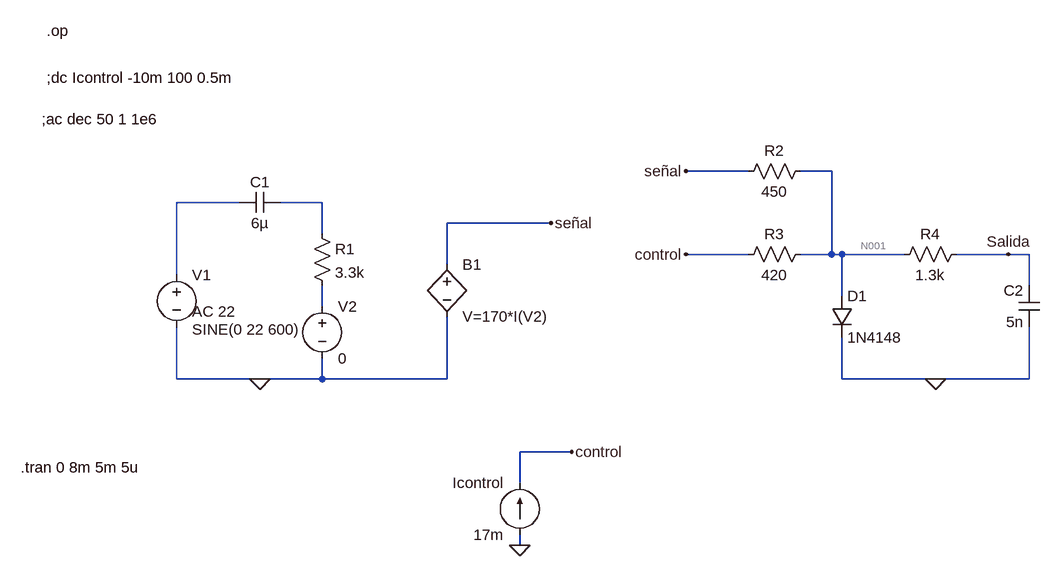
[diagram p0: schematic Draft1.asc]
Draft1.asc, the LTspice schematic file:
Version 4
SHEET 1 1340 680
WIRE 832 -96 736 -96
WIRE 960 -96 912 -96
WIRE 48 -48 -48 -48
WIRE 176 -48 112 -48
WIRE 528 -16 368 -16
WIRE 176 0 176 -48
WIRE 832 32 736 32
WIRE 960 32 960 -96
WIRE 960 32 912 32
WIRE 976 32 960 32
WIRE 1072 32 976 32
WIRE 1232 32 1152 32
WIRE 1264 32 1232 32
WIRE 368 48 368 -16
WIRE -48 64 -48 -48
WIRE 1264 80 1264 32
WIRE 976 96 976 32
WIRE 176 112 176 80
WIRE -48 224 -48 144
WIRE 80 224 -48 224
WIRE 176 224 176 192
WIRE 176 224 80 224
WIRE 368 224 368 128
WIRE 368 224 176 224
WIRE 976 224 976 160
WIRE 1120 224 976 224
WIRE 1264 224 1264 144
WIRE 1264 224 1120 224
WIRE 560 336 480 336
WIRE 480 384 480 336
WIRE 480 480 480 464
FLAG 80 224 0
FLAG 1120 224 0
FLAG 480 480 0
FLAG 736 -96 señal
FLAG 528 -16 señal
FLAG 736 32 control
FLAG 560 336 control
FLAG 1232 32 Salida
SYMBOL voltage -48 48 R0
WINDOW 3 24 100 Left 2
WINDOW 123 24 72 Left 2
WINDOW 39 0 0 Left 0
SYMATTR Value SINE(0 22 600)
SYMATTR Value2 AC 22
SYMATTR InstName V1
SYMBOL voltage 176 96 R0
WINDOW 123 0 0 Left 0
WINDOW 39 0 0 Left 0
SYMATTR InstName V2
SYMATTR Value 0
SYMBOL cap 112 -64 R90
WINDOW 0 0 32 VBottom 2
WINDOW 3 32 32 VTop 2
SYMATTR InstName C1
SYMATTR Value 6µ
SYMBOL cap 1280 144 R180
WINDOW 0 24 56 Left 2
WINDOW 3 24 8 Left 2
SYMATTR InstName C2
SYMATTR Value 5n
SYMBOL res 160 -16 R0
SYMATTR InstName R1
SYMATTR Value 3.3k
SYMBOL res 928 -112 R90
WINDOW 0 0 56 VBottom 2
WINDOW 3 32 56 VTop 2
SYMATTR InstName R2
SYMATTR Value 450
SYMBOL res 928 16 R90
WINDOW 0 0 56 VBottom 2
WINDOW 3 32 56 VTop 2
SYMATTR InstName R3
SYMATTR Value 420
SYMBOL res 1168 16 R90
WINDOW 0 0 56 VBottom 2
WINDOW 3 32 56 VTop 2
SYMATTR InstName R4
SYMATTR Value 1.3k
SYMBOL current 480 464 R180
WINDOW 0 24 80 Left 2
WINDOW 3 24 0 Left 2
WINDOW 123 0 0 Left 0
WINDOW 39 0 0 Left 0
SYMATTR InstName Icontrol
SYMATTR Value 17m
SYMBOL diode 960 96 R0
SYMATTR InstName D1
SYMATTR Value 1N4148
SYMBOL bv 368 32 R0
SYMATTR InstName B1
SYMATTR Value V=170*I(V2)
TEXT -248 -312 Left 2 !.op
TEXT -288 360 Left 2 !.tran 0 8m 5m 5u
TEXT -248 -240 Left 2 !;dc Icontrol -10m 100 0.5m
TEXT -256 -176 Left 2 !;ac dec 50 1 1e6

The netlist it stands for:
* Draft1.asc
V1 N002 0 SINE(0 22 600) AC 22
V2 N004 0 0
C1 N003 N002 6µ
C2 0 Salida 5n
R1 N003 N004 3.3k
R2 N001 señal 450
R3 N001 control 420
R4 Salida N001 1.3k
Icontrol 0 control 17m
D1 N001 0 1N4148
B1 señal 0 V=170*I(V2)
.model D D
.lib standard.dio
.op
.tran 0 8m 5m 5u
;dc Icontrol -10m 100 0.5m
;ac dec 50 1 1e6
.backanno
.end

* Results of the author's LTspice run, read from the files saved beside the schematic
* Operating Point, zero values left out:
*   V(salida) = 716.9 mV
*   V(n001) = 716.9 mV
*   V(control) = 7.857 V
*   I(B1) = 1.593 mA
*   I(D1) = 15.41 mA
*   I(Icontrol) = 17 mA
*   I(R3) = -17 mA
*   I(R2) = 1.593 mA
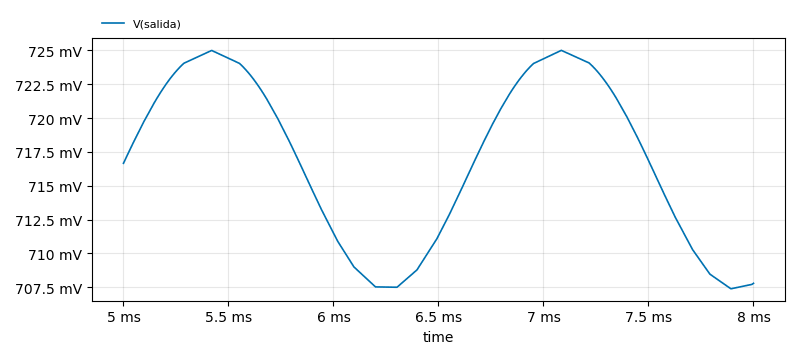
[diagram p1: Transient Analysis of Draft1.asc, plotted from the saved traces]
* Transient Analysis, 1 run:
*   V(salida): min 707.4 mV, max 725 mV, average 717 mV, rms 717 mV, last 707.8 mV